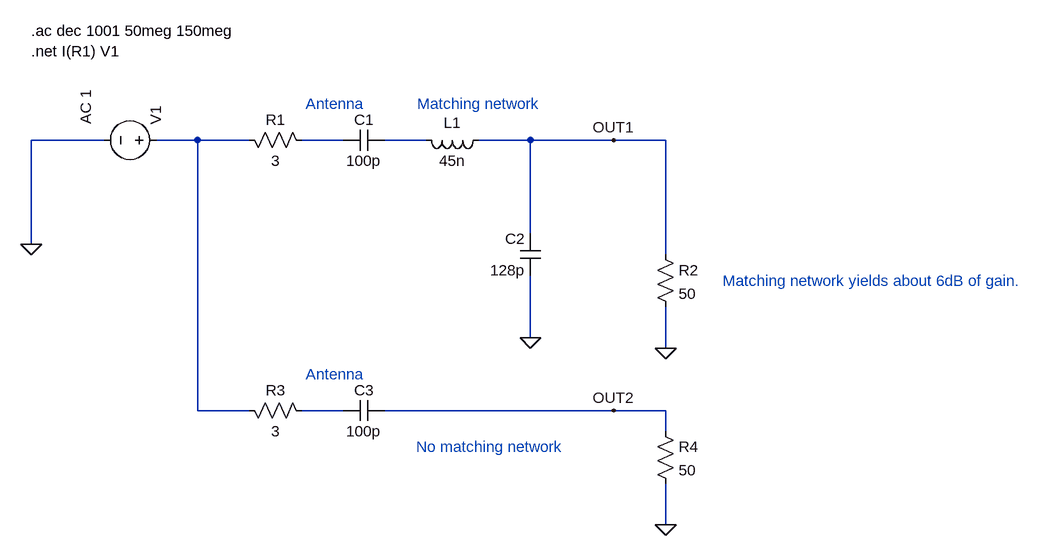
[diagram p0: schematic LC-matching.asc]
LC-matching.asc, the LTspice schematic file:
Version 4
SHEET 1 1184 680
WIRE -272 -96 -384 -96
WIRE -128 -96 -192 -96
WIRE -48 -96 -128 -96
WIRE 96 -96 32 -96
WIRE 224 -96 160 -96
WIRE 384 -96 304 -96
WIRE 512 -96 384 -96
WIRE 592 -96 512 -96
WIRE 384 48 384 -96
WIRE -384 64 -384 -96
WIRE 592 80 592 -96
WIRE 384 208 384 112
WIRE 592 224 592 160
WIRE -128 320 -128 -96
WIRE -48 320 -128 320
WIRE 96 320 32 320
WIRE 512 320 160 320
WIRE 592 320 512 320
WIRE 592 352 592 320
WIRE 592 496 592 432
FLAG 592 224 0
FLAG 384 208 0
FLAG -384 64 0
FLAG 592 496 0
FLAG 512 -96 OUT1
FLAG 512 320 OUT2
SYMBOL voltage -176 -96 M270
WINDOW 123 24 124 Left 2
WINDOW 39 24 152 Left 2
SYMATTR Value2 AC 1
SYMATTR InstName V1
SYMATTR Value ""
SYMBOL res 48 -80 M270
WINDOW 0 32 56 VTop 2
WINDOW 3 0 56 VBottom 2
SYMATTR InstName R1
SYMATTR Value 3
SYMBOL cap 160 -80 M270
WINDOW 0 32 32 VTop 2
WINDOW 3 0 32 VBottom 2
SYMATTR InstName C1
SYMATTR Value 100p
SYMBOL ind 208 -112 M90
WINDOW 0 5 56 VBottom 2
WINDOW 3 32 56 VTop 2
SYMATTR InstName L1
SYMATTR Value 45n
SYMBOL cap 400 48 M0
SYMATTR InstName C2
SYMATTR Value 128p
SYMBOL res 576 64 R0
SYMATTR InstName R2
SYMATTR Value 50
SYMBOL res 48 336 M270
WINDOW 0 32 56 VTop 2
WINDOW 3 0 56 VBottom 2
SYMATTR InstName R3
SYMATTR Value 3
SYMBOL cap 160 336 M270
WINDOW 0 32 32 VTop 2
WINDOW 3 0 32 VBottom 2
SYMATTR InstName C3
SYMATTR Value 100p
SYMBOL res 576 336 R0
SYMATTR InstName R4
SYMATTR Value 50
TEXT -384 -264 Left 2 !.ac dec 1001 50meg 150meg\n.net I(R1) V1
TEXT 128 -152 Right 2 ;Antenna
TEXT 400 -152 Right 2 ;Matching network
TEXT 128 264 Right 2 ;Antenna
TEXT 208 376 Left 2 ;No matching network
TEXT 680 120 Left 2 ;Matching network yields about 6dB of gain.

The netlist it stands for:
* LC-matching.asc
V1 N001 0 AC 1
R1 N002 N001 3
C1 N003 N002 100p
L1 N003 OUT1 45n
C2 OUT1 0 128p
R2 OUT1 0 50
R3 N004 N001 3
C3 OUT2 N004 100p
R4 OUT2 0 50
.ac dec 1001 50meg 150meg
.net I(R1) V1
* Antenna
* Matching network
* Antenna
* No matching network
* Matching network yields about 6dB of gain.
.backanno
.end